# Altium schematic sheet 01-Antennas.SchDoc
size B; SheetNumber: 1; SheetTotal: 8; SPICEModelCacheELOCFEDZ: <root> / <DocumentId>ELOCFEDZ</DocumentId> / </root>
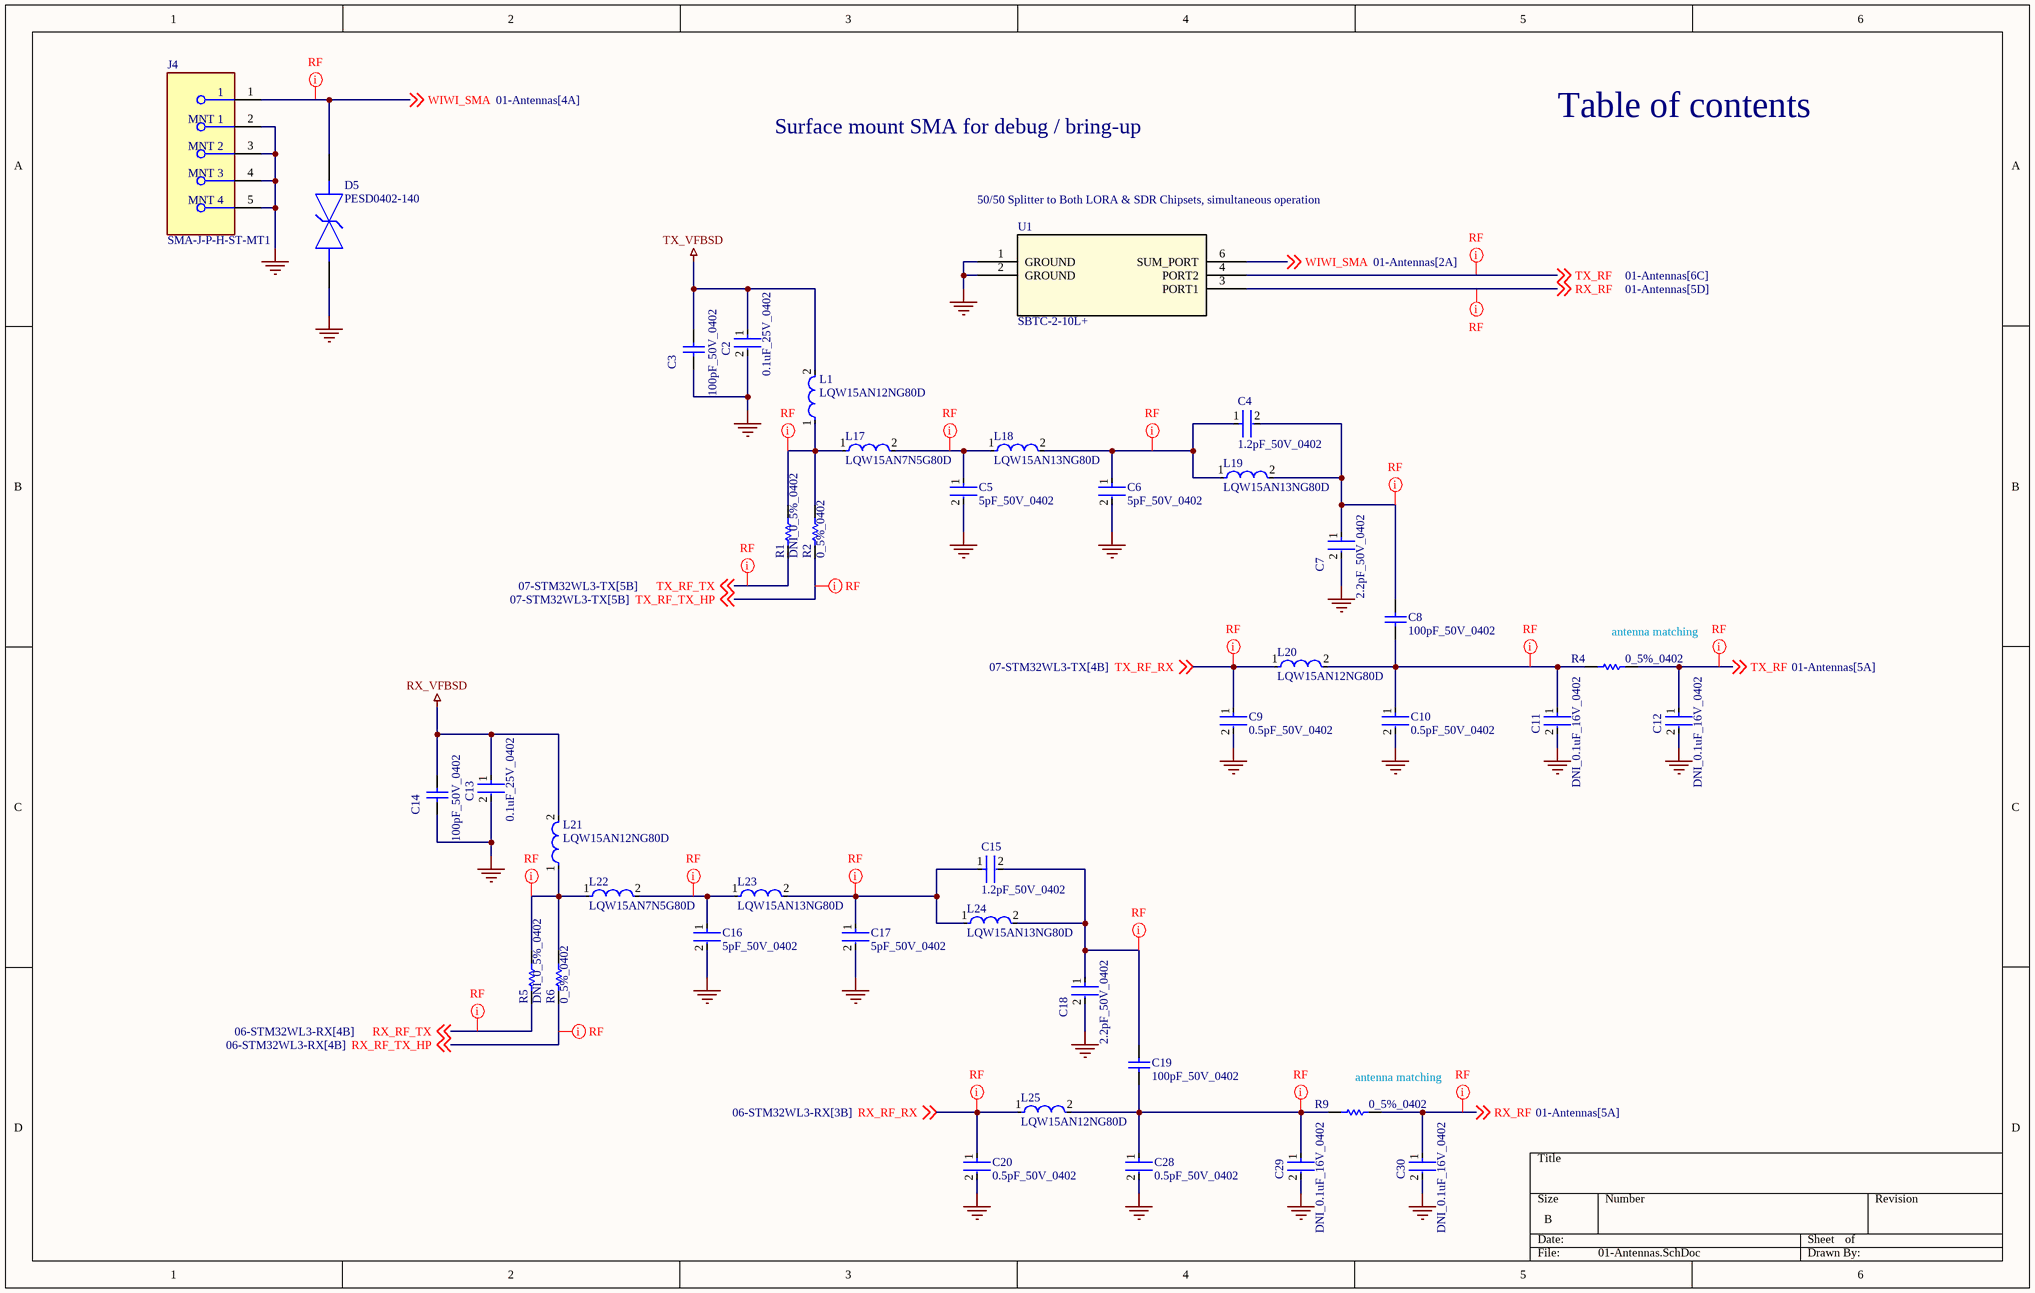
[diagram p0: 01-Antennas.SchDoc]

## Parts
C2  0.1uF_25V_0402  [FP-0402-L_1_0_1-W_0_5_0_1-IPC_C]
C3  100pF_50V_0402  [CAPC1005X55X25ML05T10]
C4  1.2pF_50V_0402  [FP-GJM155-0_05-IPC_A]
C5  5pF_50V_0402  [FP-GJM155-0_05-IPC_B]
C6  5pF_50V_0402  [FP-GJM155-0_05-IPC_B]
C7  2.2pF_50V_0402  [FP-GJM155-0_05-IPC_C]
C8  100pF_50V_0402  [CAPC1005X55X25ML05T10]
C9  0.5pF_50V_0402  [FP-GJM155-0_05-MFG]
C10  0.5pF_50V_0402  [FP-GJM155-0_05-MFG]
C11  DNI_0.1uF_16V_0402  [FP-C0402-BB-MFG]  (no BOM)
C12  DNI_0.1uF_16V_0402  [FP-C0402-BB-MFG]  (no BOM)
C13  0.1uF_25V_0402  [FP-0402-L_1_0_1-W_0_5_0_1-IPC_C]
C14  100pF_50V_0402  [CAPC1005X55X25ML05T10]
C15  1.2pF_50V_0402  [FP-GJM155-0_05-IPC_A]
C16  5pF_50V_0402  [FP-GJM155-0_05-IPC_B]
C17  5pF_50V_0402  [FP-GJM155-0_05-IPC_B]
C18  2.2pF_50V_0402  [FP-GJM155-0_05-IPC_C]
C19  100pF_50V_0402  [CAPC1005X55X25ML05T10]
C20  0.5pF_50V_0402  [FP-GJM155-0_05-MFG]
C28  0.5pF_50V_0402  [FP-GJM155-0_05-MFG]
C29  DNI_0.1uF_16V_0402  [FP-C0402-BB-MFG]  (no BOM)
C30  DNI_0.1uF_16V_0402  [FP-C0402-BB-MFG]  (no BOM)
D5  PESD0402-140  [FP-PESD0402-MFG]
J4  SMA-J-P-H-ST-MT1  [FP-SMA-J-P-H-ST-MT1-MFG]
L1  LQW15AN12NG80D  [FP-LQW15AN_80-MFG]
L17  LQW15AN7N5G80D  [FP-LQW15AN_80-MFG]
L18  LQW15AN13NG80D  [FP-LQW15AN_80-MFG]
L19  LQW15AN13NG80D  [FP-LQW15AN_80-MFG]
L20  LQW15AN12NG80D  [FP-LQW15AN_80-MFG]
L21  LQW15AN12NG80D  [FP-LQW15AN_80-MFG]
L22  LQW15AN7N5G80D  [FP-LQW15AN_80-MFG]
L23  LQW15AN13NG80D  [FP-LQW15AN_80-MFG]
L24  LQW15AN13NG80D  [FP-LQW15AN_80-MFG]
L25  LQW15AN12NG80D  [FP-LQW15AN_80-MFG]
R1  DNI_0_5%_0402  [RESC1005X40X25NL05T10]  (no BOM)
R2  0_5%_0402  [RESC1005X40X25NL05T10]
R4  0_5%_0402  [RESC1005X40X25NL05T10]
R5  DNI_0_5%_0402  [RESC1005X40X25NL05T10]  (no BOM)
R6  0_5%_0402  [RESC1005X40X25NL05T10]
R9  0_5%_0402  [RESC1005X40X25NL05T10]
U1  SBTC-2-10L+  [AT1029_MNC]

## Nets
GND: C2.2 C3.1 C5.2 C6.2 C7.2 C9.2 C10.2 C11.2 C12.2 C13.2 C14.1 C16.2 C17.2 C18.2 C20.2 C28.2 C29.2 C30.2 D5.1 J4.2(MNT_1) J4.3(MNT_2) J4.4(MNT_3) J4.5(MNT_4) U1.1(GROUND) U1.2(GROUND)
RX_VFBSD: C13.1 C14.2 L21.2
TX_VFBSD: C2.1 C3.2 L1.2
RX_RF: C30.1 R9.2 U1.3(PORT1) ; off-sheet RX_RF
RX_RF_RX: C20.1 L25.1 ; off-sheet RX_RF_RX
RX_RF_TX: R5.1 ; off-sheet RX_RF_TX
RX_RF_TX_HP: R6.1 ; off-sheet RX_RF_TX_HP
TX_RF: C12.1 R4.2 U1.4(PORT2) ; off-sheet TX_RF
TX_RF_RX: C9.1 L20.1 ; off-sheet TX_RF_RX
TX_RF_TX: R1.1 ; off-sheet TX_RF_TX
TX_RF_TX_HP: R2.1 ; off-sheet TX_RF_TX_HP
WIWI_SMA: D5.2 J4.1 U1.6(SUM_PORT) ; off-sheet WIWI_SMA
NetC4_1: C4.1 C6.1 L18.2 L19.1
NetC4_2: C4.2 C7.1 C8.2 L19.2
NetC5_1: C5.1 L17.2 L18.1
NetC8_1: C8.1 C10.1 C11.1 L20.2 R4.1
NetC15_1: C15.1 C17.1 L23.2 L24.1
NetC15_2: C15.2 C18.1 C19.2 L24.2
NetC16_1: C16.1 L22.2 L23.1
NetC19_1: C19.1 C28.1 C29.1 L25.2 R9.1
NetL1_1: L1.1 L17.1 R1.2 R2.2
NetL21_1: L21.1 L22.1 R5.2 R6.2

## Layout directives
net class RF: NetC4_1, NetC4_2, NetC5_1, NetC8_1, NetC15_1, NetC15_2, NetC16_1, NetC19_1, NetL1_1, NetL21_1, RX_RF, RX_RF_RX, RX_RF_TX, RX_RF_TX_HP, TX_RF, TX_RF_RX, TX_RF_TX, TX_RF_TX_HP, WIWI_SMA

## Notes on the sheet
- Surface mount SMA for debug / bring-up
- Table of contents
- 50/50 Splitter to Both LORA & SDR Chipsets, simultaneous operation
- (near R4) antenna matching
- (near R9) antenna matching

## Library data of the parts
C2 C13 = CMP-2008-02519-2: General Purpose Ceramic Capacitor, 0402, 100nF, 10%, X7R, 15%, 25V; Package Quantity: 1; Capacitance: 100nF; Min Operating Temperature: -55°C; Voltage: 25V; Voltage Rating: 25V; Construction: Flat; Max Operating Temperature: 125°C; Radiation Hardening: No; Depth: 0.5mm; Thickness: 0.022inch; Voltage Rating (DC): 25V; Number of Pins: 2; Lead Free: Lead Free; Series: -; REACH SVHC: No SVHC; Length: 1mm; Dielectric: X7R; RoHS Compliant: Yes; Mount: Surface Mount; Packaging: Tape and Reel; Case/Package: 0402; Case Code (Imperial): 0402; Termination: SMD/SMT; Width: 0.02inch; Case Code (Metric): 1005; Tolerance: 10%
C3 C8 C14 C19 = CMP-2008-03915-1: Manufacturer: Murata; Part Number: GRM1555C1H101JA01D
C4 C15 = CMP-2008-03815-2: Multi-Layer Ceramic Capacitor 1.2pF C0G  ±0.05pF 0402 Paper T/R; Voltage Rating: 50V; Min Operating Temperature: -55°C; Length: 1mm; Package Quantity: 10000; Depth: 0.5mm; Radiation Hardening: No; Case/Package: 0402; Mount: Surface Mount; Dielectric: C0G; Case Code (Metric): 1005; Case Code (Imperial): 0402; Height: 0.5mm; Packaging: Tape and Reel; Width: 0.02inch; Voltage Rating (DC): 50V; Capacitance: 1.2pF; Lead Free: Lead Free; Termination: SMD/SMT; Voltage: 50V; Max Operating Temperature: 125°C; Thickness: 0.022inch
C5 C6 C16 C17 = CMP-06035-005630-1: Multi-Layer Ceramic Capacitor 5pF C0G  ±0.05pF 0402 Paper T/R; Voltage Rating (DC): 50V; Capacitance: 5pF; Case Code (Metric): 1005; Radiation Hardening: No; Package Quantity: 10000; Case Code (Imperial): 0402; Termination: SMD/SMT; Min Operating Temperature: -55°C; Depth: 0.5mm; Packaging: Tape and Reel; Length: 1mm; Dielectric: C0G; Width: 0.5mm; Height: 0.5mm; Case/Package: 0402; Thickness: 0.022inch; Max Operating Temperature: 125°C; Voltage Rating: 50V; Mount: Surface Mount
C7 C18 = CMP-2008-03837-2: Multi-Layer Ceramic Capacitor 2.2pF C0G  ±0.05pF 0402 Paper T/R; Voltage Rating: 50V; Case/Package: 0402; Termination: SMD/SMT; Package Quantity: 10000; Construction: Flat; Width: 0.02inch; Length: 0.039inch; Dielectric: C0G; Mount: Surface Mount; Radiation Hardening: No; Case Code (Imperial): 0402; Depth: 0.5mm; Case Code (Metric): 1005; Packaging: Tape and Reel; Height: 0.5mm; Series: GJM; Thickness: 0.022inch; Max Operating Temperature: 125°C; Lead Free: Lead Free; Min Operating Temperature: -55°C; Voltage Rating (DC): 50V; Capacitance: 2.2pF
C9 C10 C20 C28 = CMP-2008-03904-2: Multi-Layer Ceramic Capacitor 0.5pF C0G  ±0.1pF 0402 Paper T/R; Voltage Rating (DC): 50V; Temperature Coefficient: 30ppm/°C; Lead Pitch: 0.3mm; Max Operating Temperature: 125°C; Thickness: 0.022inch; Termination: SMD/SMT; Depth: 0.5mm; Height: 0.5mm; Voltage Rating: 50V; Length: 1mm; Case/Package: 0402; Radiation Hardening: No; Min Operating Temperature: -55°C; Width: 0.02inch; Voltage: 50V; Number of Pins: 2; REACH SVHC: No SVHC; Case Code (Imperial): 0402; Package Quantity: 1; Mount: Surface Mount; Capacitance: 0.5pF; Dielectric: C0G; Lead Free: Lead Free; Case Code (Metric): 1005; Packaging: Tape and Reel
C11 C12 C29 C30 = CMP-1034-02068-3: CAP CER 0.1UF 16V 5% X7R 0402; Manufacturer: Kemet; Manufacturer Part Number: C0402C104J4RACTU; Value: 0.10 μF; Temperature Coefficient: 15%; Tolerance: 0.05; Material: Ceramic; ComponentLink2URL: https://content.kemet.com/datasheets/KEM_C1002_X7R_SMD.pdf; Automotive: No; Device Class L2: Capacitors; Temperature: -55°C to +125°C; RoHS: TRUE; Voltage Rating: 16 V; ComponentLink2Description: Datasheet; Device Class L3: Ceramic Capacitors; Temperature Range Low: -55°C; Ipc Land Pattern Name: CAPC10050X50; Device Class L1: Passive Components; Temperature Range High: +125°C; Package: C0402-BB; Capacitance: 0.10 μF; Category: Cap; Mouser Description: CAP CER 0.1UF 16V X7R 0402; Height: 0.55mm; Digikey Description: CAP CER 0.1UF 16V 5% X7R 0402; Octopart: https://octopart.com/c0402c104j4ractu-kemet-12573893; Temperature Characteristic: X7R; Lead Free: Yes
D5 = CMP-08607-000011-1: TVS DIODE 14V 40V 0402; Manufacturer: Littelfuse Inc.; Automotive Grade: Grade 1; Capacitance: 0.25pF; Value: 0.25pF; Direction: Bidirectional; Number Of Channels: 1; Temperature Range Low: -55°C; Lead Free: Yes; Temperature: -55°C to +125°C; Digikey Description: TVS DIODE 14V 40V 0402; Automotive: Yes; Device Class L2: TVS Diodes; Reverse Standoff Voltage: 14V; Device Class L1: Circuit Protection; Ipc Land Pattern Name: DIOC10050X33; Manufacturer Part Number: PESD0402-140; Breakdown Voltage: 14V; Height: 0.43mm; Clamping Voltage: 40V; RoHS: TRUE; Temperature Range High: +125°C; Device Class L3: unset; Octopart: https://octopart.com/pesd0402-140-littelfuse-74215061; Package: PESD0402; ComponentLink2URL: https://www.littelfuse.com/~/media/electronics/datasheets/polymer_esd_suppressors/littelfuse_polymer_esd_suppressor_pesd_catalog_datasheet.pdf.pdf; Category: Diode; ComponentLink2Description: Datasheet
J4 = CMP-02754-000007-1: CONN SMA JACK STR 50 OHM SMD; Dielectric Material: PTFE; Voltage Rating: 335V; Body Material: Brass; Center Contact Plating: Gold; Impedance: 50R; Number of Ports: 1; Max Frequency: 20GHz; Mount: Surface Mount; Contact Plating: Gold; Housing Color: Gold; Series: -; Fastening Type: Threaded; Packaging: Bulk; Connector Type: SMA; Contact Material: Copper Alloy; Body Plating: Gold; Case/Package: SMA; Termination: Solder; RoHS Compliant: No; Min Operating Temperature: -65°C; Max Operating Temperature: 125°C
L1 L20 L21 L25 = CMP-06042-001817-1: Wire Wound RF Inductor 12nH ±2% 1240mA 0.093Ω 0402 (1005); Test Frequency: 100MHz; DC Resistance (DCR): 93mR; Self Resonant Frequency: 5.2GHz; Shielding: Unshielded; Max DC Current: 1.24A; Q Factor: 30; Core Material: Ferrite; Package Quantity: 10000; Case Code (Imperial): 0402; Inductance: 12nH; Packaging: Tape and Reel; Min Operating Temperature: -55°C; Mount: Surface Mount; Length: 0.039inch; Height: 0.5mm; Max Operating Temperature: 125°C; Case Code (Metric): 1005; Resistor Type: Wirewound; Height - Seated (Max): 0.024inch; Termination: SMD/SMT; Tolerance: 2%; Current Rating: 1.24A; Width: 0.024inch; Case/Package: 0402
L17 L22 = CMP-06042-000856-1: Wire Wound RF Inductor 7.5nH ±2% 1700mA 0.05Ω 0402 (1005); Max DC Current: 1.7A; Shielding: Unshielded; Core Material: Ferrite; Self Resonant Frequency: 7GHz; DC Resistance (DCR): 50mR; Test Frequency: 100MHz; Q Factor: 35; Inductance: 7.5nH; Mount: Surface Mount; Length: 0.039inch; Width: 0.024inch; Case Code (Metric): 0402; Min Operating Temperature: -55°C; Current Rating: 1.7A; Package Quantity: 10000; Tolerance: 2%; Height: 0.5mm; Case/Package: 0402; Height - Seated (Max): 0.024inch; Max Operating Temperature: 125°C; Termination: SMD/SMT; Case Code (Imperial): 1005; Resistor Type: Wirewound; Packaging: Tape and Reel
L18 L19 L23 L24 = CMP-06042-008137-1: Wire Wound RF Inductor 13nH ±2% 1240mA 0.093Ω 0402 (1005); Core Material: Ferrite; Q Factor: 30; DC Resistance (DCR): 93mR; Current Rating: 1.24A; Shielding: Unshielded; Test Frequency: 100MHz; Self Resonant Frequency: 5.2GHz; Case Code (Imperial): 0402; Max Operating Temperature: 125°C; Height: 0.5mm; Case Code (Metric): 1005; Packaging: Tape and Reel; Package Quantity: 10000; Mount: Surface Mount; Tolerance: 2%; Case/Package: 0402; Resistor Type: Wirewound; Min Operating Temperature: -55°C; Length: 0.039inch; Termination: SMD/SMT; Max DC Current: 1.24A; Inductance: 13nH; Width: 0.024inch; Height - Seated (Max): 0.024inch
R1 R2 R4-R6 R9 = CMP-2002-06457-1: Manufacturer: Panasonic; Part Number: ERJ-U020R00X
U1 = SBTC-2-10L+: No Description Available; Mfr_Name: Mini Circuits; Copyright: Copyright (C) 2023 Ultra Librarian. All rights reserved.; Manufacturer_Part_Number: SBTC-2-10L+; RefDes: RefDes; Type: DEV